# EAGLE schematic basic-inline-turbidimeter_main_board (EAGLE 7.1.0)
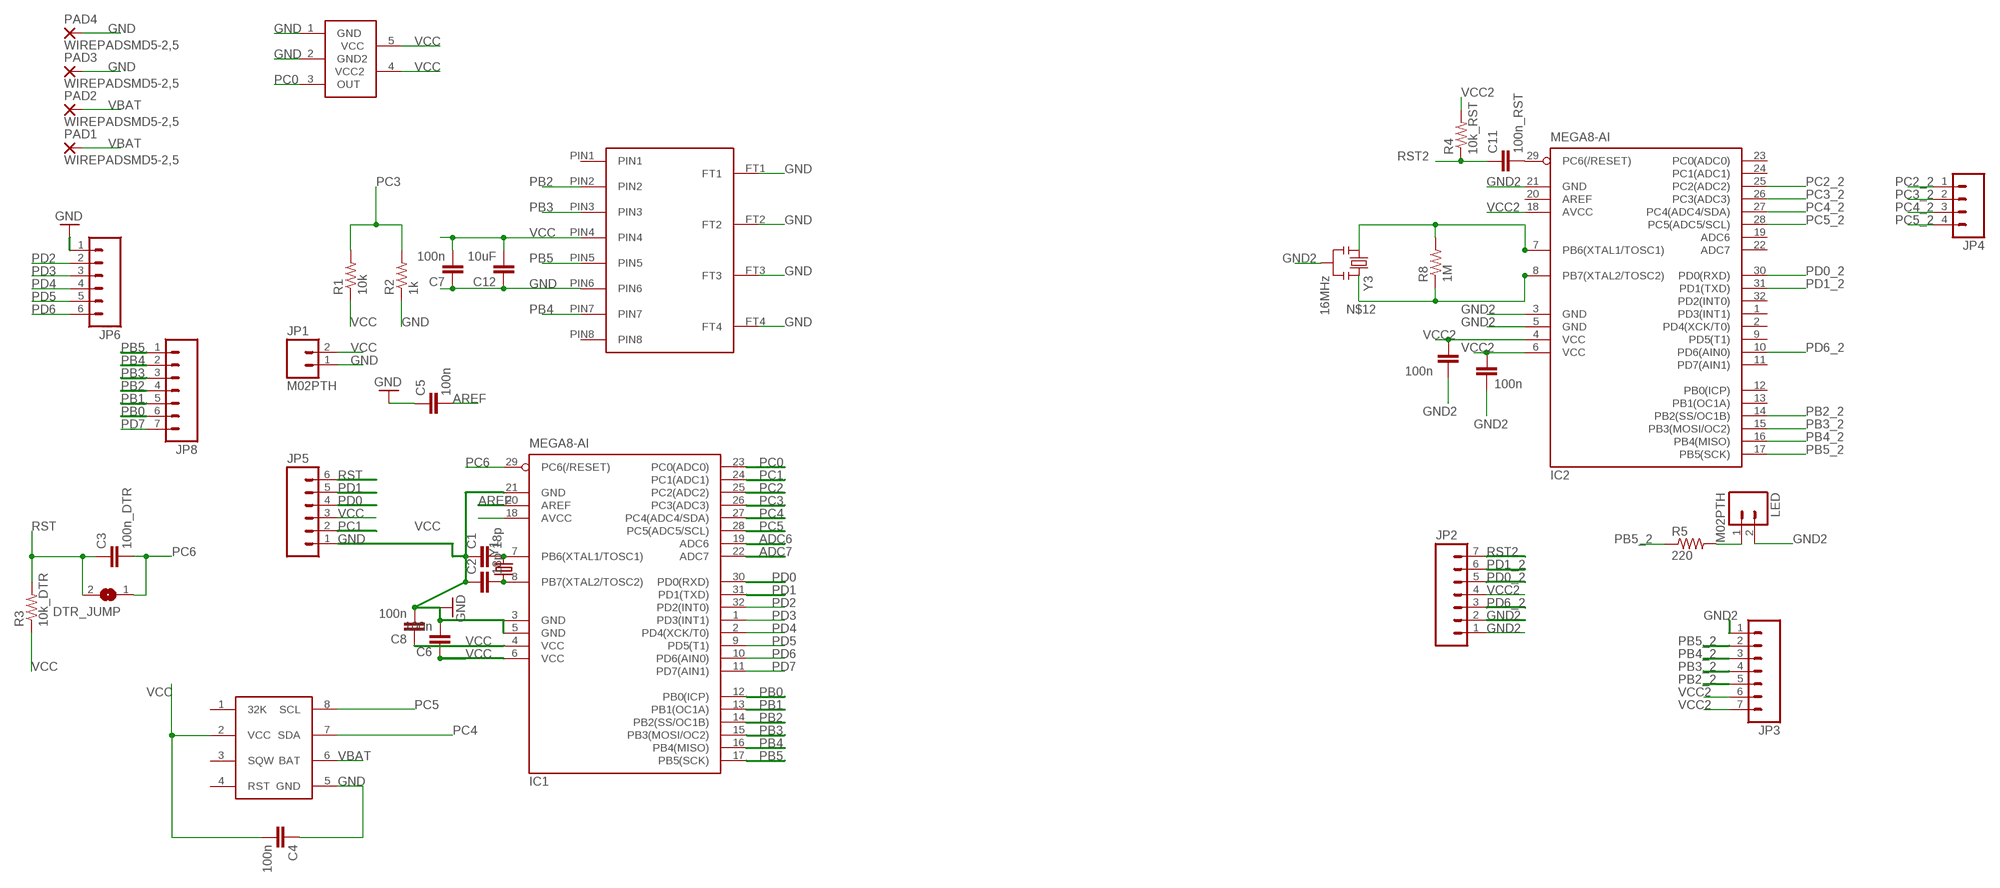
[diagram p0: schematic, sheet 1]

## Parts
*RTC  DS3231M  [DS3231M]
C1  18p  CAP0603-CAP  [0603-CAP]
C2  18p  CAP0603-CAP  [0603-CAP]
C3  100n_DTR  CAP0603-CAP  [0603-CAP]
C4  100n  CAP0603-CAP  [0603-CAP]
C5  100n  CAP0603-CAP  [0603-CAP]
C6  100n  CAP0603-CAP  [0603-CAP]
C7  100n  CAP0603-CAP  [0603-CAP]
C8  100n  CAP0603-CAP  [0603-CAP]
C9  100n  CAP0603-CAP  [0603-CAP]
C10  100n  CAP0603-CAP  [0603-CAP]
C11  100n_RST  CAP0603-CAP  [0603-CAP]
C12  10uF  CAP0603-CAP  [0603-CAP]
DTR_JUMP  SJ  [SJ]
IC1  MEGA8-AI  [TQFP32-08]
IC2  MEGA8-AI  [TQFP32-08]
JP1  M02PTH  [1X02]
JP2  M07  [1X07]
JP3  M07  [1X07]
JP4  M04PTH  [1X04]
JP5  M06SIP  [1X06]
JP6  M06SIP  [1X06]
JP8  M07  [1X07]
LED  M02PTH  [1X02]
MICRO-SD  MICROSD-1010030368  [MICROSD-1010030368]
PAD1  WIREPADSMD5-2,5  [5-2,5]
PAD2  WIREPADSMD5-2,5  [5-2,5]
PAD3  WIREPADSMD5-2,5  [5-2,5]
PAD4  WIREPADSMD5-2,5  [5-2,5]
R1  10k  RESISTOR0603  [0603-RES]
R2  1k  RESISTOR0603  [0603-RES]
R3  10k_DTR  RESISTOR0603  [0603-RES]
R4  10k_RST  RESISTOR0603  [0603-RES]
R5  220  RESISTOR0603  [0603-RES]
R8  1M  RESISTOR0603  [0603-RES]
U$4  LMT86  [LMT86]
Y1  CRYSTAL5X3  [CRYSTAL-SMD-5X3]
Y3  16MHz  RESONATOR16MHZ  [RESONATOR-SMD]

## Nets
ADC6: IC1.19(ADC6)
ADC7: IC1.22(ADC7)
AREF: C5.2 IC1.20(AREF)
GND: *RTC.5(GND) C1.1 C2.1 C4.1 C5.1 C6.2 C7.1 C8.2 C12.1 IC1.3(GND) IC1.5(GND) IC1.21(GND) JP1.1 JP5.1 JP6.1 MICRO-SD.FT1 MICRO-SD.FT2 MICRO-SD.FT3 MICRO-SD.FT4 MICRO-SD.PIN6 PAD3.1(P) PAD4.1(P) R2.1 U$4.1(GND) U$4.2(GND2)
GND2: C9.2 C10.2 IC2.3(GND) IC2.5(GND) IC2.21(GND) JP2.1 JP2.2 JP3.1 LED.2 Y3.2
N$2: C11.2 IC2.29(PC6(/RESET))
N$9: LED.1 R5.2
N$11: IC2.7(PB6(XTAL1/TOSC1)) R8.2 Y3.1
N$12: IC2.8(PB7(XTAL2/TOSC2)) R8.1 Y3.3
PB0: IC1.12(PB0(ICP)) JP8.6
PB1: IC1.13(PB1(OC1A)) JP8.5
PB2: IC1.14(PB2(SS/OC1B)) JP8.4 MICRO-SD.PIN2
PB2_2: IC2.14(PB2(SS/OC1B)) JP3.5
PB3: IC1.15(PB3(MOSI/OC2)) JP8.3 MICRO-SD.PIN3
PB3_2: IC2.15(PB3(MOSI/OC2)) JP3.4
PB4: IC1.16(PB4(MISO)) JP8.2 MICRO-SD.PIN7
PB4_2: IC2.16(PB4(MISO)) JP3.3
PB5: IC1.17(PB5(SCK)) JP8.1 MICRO-SD.PIN5
PB5_2: IC2.17(PB5(SCK)) JP3.2 R5.1
PC0: IC1.23(PC0(ADC0)) U$4.3(OUT)
PC1: IC1.24(PC1(ADC1)) JP5.2
PC2: IC1.25(PC2(ADC2))
PC2_2: IC2.25(PC2(ADC2)) JP4.1
PC3: IC1.26(PC3(ADC3)) R1.2 R2.2
PC3_2: IC2.26(PC3(ADC3)) JP4.2
PC4: *RTC.7(SDA) IC1.27(PC4(ADC4/SDA))
PC4_2: IC2.27(PC4(ADC4/SDA)) JP4.3
PC5: *RTC.8(SCL) IC1.28(PC5(ADC5/SCL))
PC5_2: IC2.28(PC5(ADC5/SCL)) JP4.4
PC6: C3.2 DTR_JUMP.1 IC1.29(PC6(/RESET))
PD0: IC1.30(PD0(RXD)) JP5.4
PD0_2: IC2.30(PD0(RXD)) JP2.5
PD1: IC1.31(PD1(TXD)) JP5.5
PD1_2: IC2.31(PD1(TXD)) JP2.6
PD2: IC1.32(PD2(INT0)) JP6.2
PD3: IC1.1(PD3(INT1)) JP6.3
PD4: IC1.2(PD4(XCK/T0)) JP6.4
PD5: IC1.9(PD5(T1)) JP6.5
PD6: IC1.10(PD6(AIN0)) JP6.6
PD6_2: IC2.10(PD6(AIN0)) JP2.3
PD7: IC1.11(PD7(AIN1)) JP8.7
Q1: C2.2 IC1.8(PB7(XTAL2/TOSC2)) Y1.1
Q2: C1.2 IC1.7(PB6(XTAL1/TOSC1)) Y1.3
RST: C3.1 DTR_JUMP.2 JP5.6 R3.2
RST2: C11.1 JP2.7 R4.1
VBAT: *RTC.6(BAT) PAD1.1(P) PAD2.1(P)
VCC: *RTC.2(VCC) C4.2 C6.1 C7.2 C8.1 C12.2 IC1.4(VCC) IC1.6(VCC) IC1.18(AVCC) JP1.2 JP5.3 MICRO-SD.PIN4 R1.1 R3.1 U$4.4(VCC2) U$4.5(VCC)
VCC2: C9.1 C10.1 IC2.4(VCC) IC2.6(VCC) IC2.18(AVCC) JP2.4 JP3.6 JP3.7 R4.2
Unconnected: *RTC.1(32K) *RTC.3(SQW) *RTC.4(RST) IC2.1(PD3(INT1)) IC2.2(PD4(XCK/T0)) IC2.9(PD5(T1)) IC2.11(PD7(AIN1)) IC2.12(PB0(ICP)) IC2.13(PB1(OC1A)) IC2.19(ADC6) IC2.20(AREF) IC2.22(ADC7) IC2.23(PC0(ADC0)) IC2.24(PC1(ADC1)) IC2.32(PD2(INT0)) MICRO-SD.PIN1 MICRO-SD.PIN8

## Library data of the parts
*RTC = open_source_turbidimeter:DS3231M
C1-C12 = SparkFun:CAP: Capacitor Standard 0603 ceramic capacitor, and 0.1" leaded capacitor.
DTR_JUMP = jumper:SJ: SMD solder JUMPER
IC1 IC2 = atmel:MEGA8: MICROCONTROLLER 8 Kbytes FLASH, 1 kbytes SRAM, 512 bytes EEPROM, USART, 6-channel 10 bit ADC, 2-channel 8 bit ADC Pin compatible with Atmega48, ATMega88, ATMega168 Source: avr.lbr; MPN: ATMEGA8-16AU; OC_FARNELL: 9171371; OC_NEWARK: 73M8863
JP1 LED = SparkFun-Connectors:M02: Standard 2-pin 0.1" header. Use with - straight break away headers ( PRT-00116) - right angle break away headers (PRT-00553) - swiss pins (PRT-00743) - machine pins (PRT-00117) - female headers (PRT-00115) Molex polarized connector foot print use with: PRT-08233 with associated crimp pins and housings. 2.54_SCREWTERM for use with PRT-10571. 3.5mm Screw Terminal footprints for PRT-08084 5mm Screw Terminal footprints for use with PRT-08433
JP2 JP3 JP8 = SparkFun:M07: Header 7 Standard 7-pin 0.1" header. Use with straight break away headers (SKU : PRT-00116), right angle break away headers (PRT-00553), swiss pins (PRT-00743), machine pins (PRT-00117), and female headers (PRT-00115). NOTES ON THE VARIANTS LOCK and LOCK_LONGPADS... This footprint was designed to help hold the alignment of a through-hole component (i.e. 7-pin header) while soldering it into place. You may notice that each hole has been shifted either up or down by 0.005 of an inch from it's more standard position (which is usually a perfectly straight line). This slight alteration caused the pins (the squares in the middle) to touch the edges of the holes. Because they are alternating, it causes a "brace" to hold the header in place. 0.005 has proven to be the perfect amount of "off-center" position when using our standard breakaway headers. Although looks a little odd when you look at the bare footprint, once you have a header in there, the alteration is very hard to notice. Also, if you push a header all the way into place, it is covered up entirely on the bottom side. This idea of altering the position of holes to aid alignment will be further integrated into the Sparkfun Library for other footprints. It can help hold any component with 3 or more connection pins.
JP4 = SparkFun-Connectors:M04: Header 4 Standard 4-pin 0.1" header. Use with straight break away headers (SKU : PRT-00116), right angle break away headers (PRT-00553), swiss pins (PRT-00743), machine pins (PRT-00117), and female headers (PRT-00115). Molex polarized connector foot print use with SKU : PRT-08231 with associated crimp pins and housings. 1MM SMD Version SKU: PRT-10208
JP5 JP6 = SparkFun-Connectors:M06: Header 6 Standard 6-pin 0.1" header. Use with straight break away headers (SKU : PRT-00116), right angle break away headers (PRT-00553), swiss pins (PRT-00743), machine pins (PRT-00117), and female headers (PRT-00115). Molex polarized connector foot print use with SKU : PRT-08094 with associated crimp pins and housings. NOTES ON THE VARIANTS LOCK and LOCK_LONGPADS... This footprint was designed to help hold the alignment of a through-hole component (i.e. 6-pin header) while soldering it into place. You may notice that each hole has been shifted either up or down by 0.005 of an inch from it's more standard position (which is a perfectly straight line). This slight alteration caused the pins (the squares in the middle) to touch the edges of the holes. Because they are alternating, it causes a "brace" to hold the component in place. 0.005 has proven to be the perfect amount of "off-center" position when using our standard breakaway headers. Although looks a little odd when you look at the bare footprint, once you have a header in there, the alteration is very hard to notice. Also,if you push a header all the way into place, it is covered up entirely on the bottom side. This idea of altering the position of holes to aid alignment will be further integrated into the Sparkfun Library for other footprints. It can help hold any component with 3 or more connection pins.
MICRO-SD = open_source_turbidimeter:MICROSD-1010030368
PAD1-PAD4 = wirepad:WIREPAD: Wire PAD connect wire on PCB
R1-R5 R8 = SparkFun-Resistors:RESISTOR: Resistor Basic schematic elements and footprints for 0603, 1206, and PTH resistors.
U$4 = open_source_turbidimeter:LMT86
Y1 = SparkFun:CRYSTAL: Crystals Various standard crystals. Proven footprints. Spark Fun Electronics SKU : COM-00534
Y3 = SparkFun-FreqCtrl:RESONATOR: Resonator Small SMD resonator. Used, eg, on the Arduino Pro/ Pro Mini boards. 8MHz- XTAL-08895 16MHz- XTAL-08900; PROD_ID: XTAL-08900